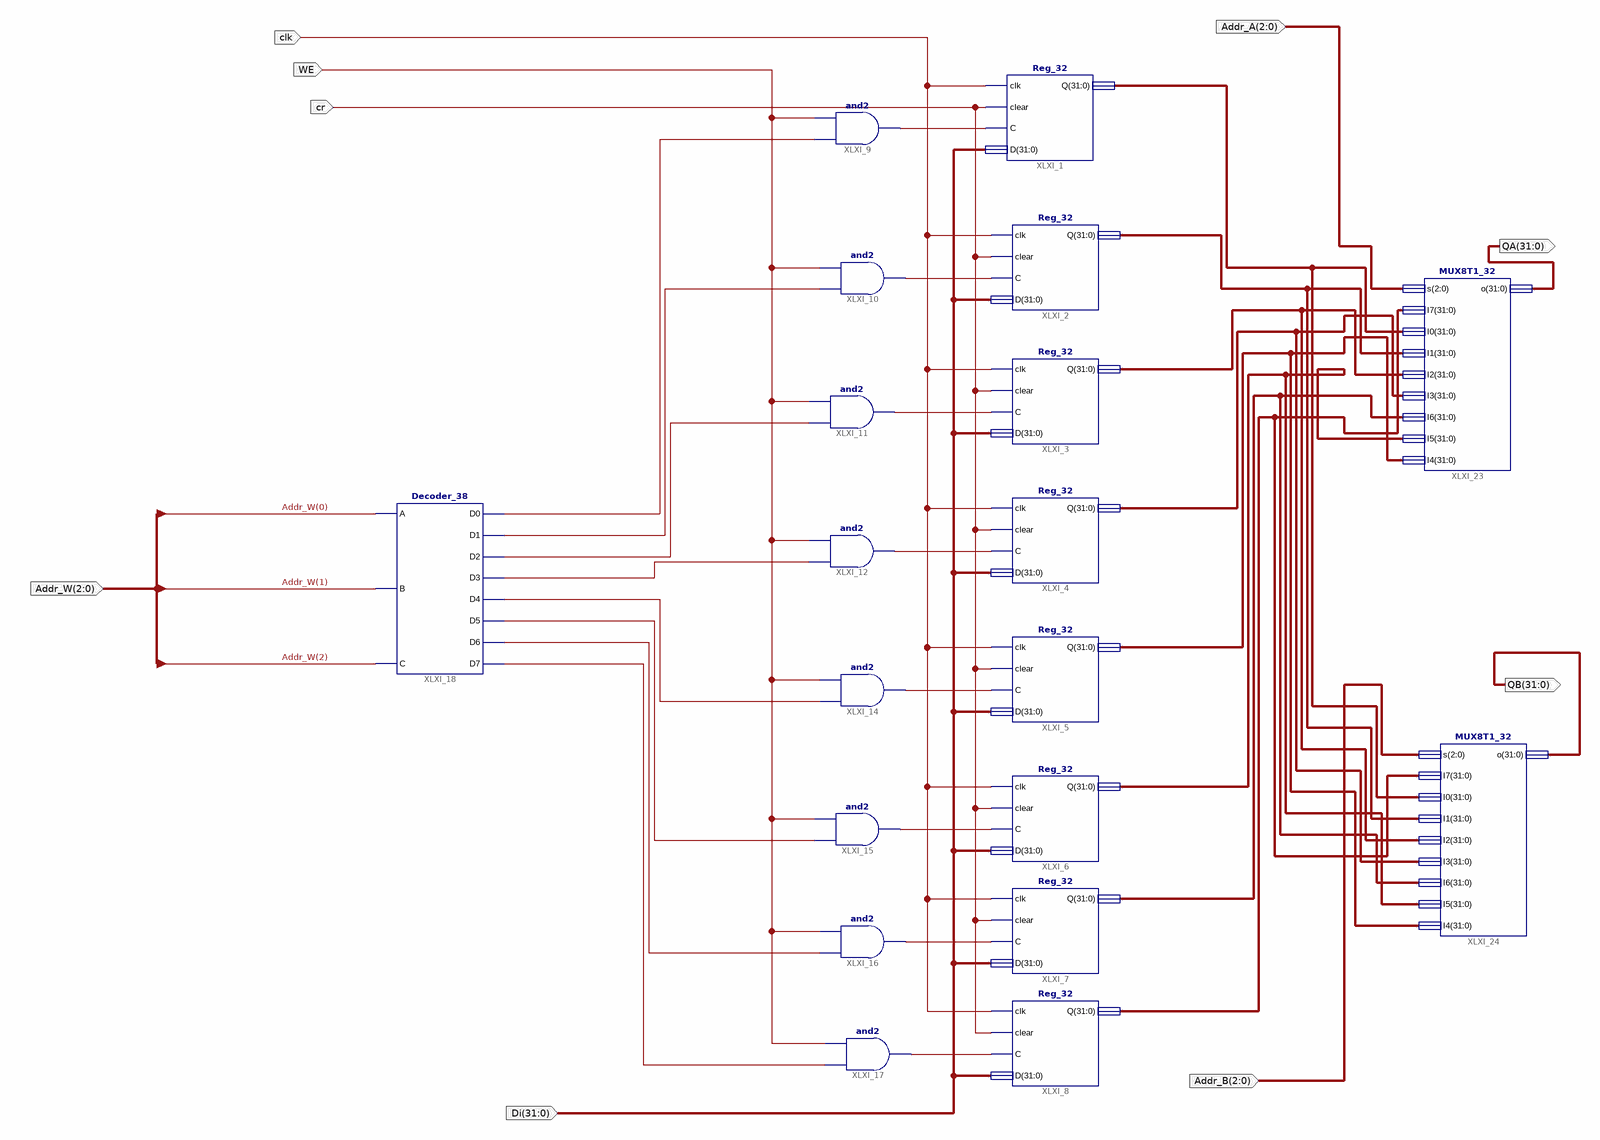
[diagram p0: schematic sheet 1]
// Xilinx ISE schematic Regs_8_32.sch (kintex7) as structural Verilog: 19 symbols, 9 ports
module Regs_8_32 (
  input  clk,
  input  [31:0] Di,
  input  [2:0] Addr_W,
  input  WE,
  input  [2:0] Addr_A,
  input  [2:0] Addr_B,
  input  cr,
  output [31:0] QA,
  output [31:0] QB
);

  wire XLXN_1, XLXN_2, XLXN_3, XLXN_4, XLXN_5, XLXN_6, XLXN_7, XLXN_8, XLXN_37, XLXN_38, XLXN_39, XLXN_40,
       XLXN_41, XLXN_42, XLXN_43, XLXN_44;
  wire [31:0] XLXN_45, XLXN_46, XLXN_49, XLXN_50, XLXN_51, XLXN_52, XLXN_53, XLXN_54;

  Reg_32 XLXI_1 (.clk(clk), .clear(cr), .C(XLXN_1), .D(Di), .Q(XLXN_45));
  Reg_32 XLXI_2 (.clk(clk), .clear(cr), .C(XLXN_2), .D(Di), .Q(XLXN_46));
  Reg_32 XLXI_3 (.clk(clk), .clear(cr), .C(XLXN_3), .D(Di), .Q(XLXN_49));
  Reg_32 XLXI_4 (.clk(clk), .clear(cr), .C(XLXN_4), .D(Di), .Q(XLXN_50));
  Reg_32 XLXI_5 (.clk(clk), .clear(cr), .C(XLXN_5), .D(Di), .Q(XLXN_51));
  Reg_32 XLXI_6 (.clk(clk), .clear(cr), .C(XLXN_6), .D(Di), .Q(XLXN_52));
  Reg_32 XLXI_7 (.clk(clk), .clear(cr), .C(XLXN_7), .D(Di), .Q(XLXN_53));
  Reg_32 XLXI_8 (.clk(clk), .clear(cr), .C(XLXN_8), .D(Di), .Q(XLXN_54));
  and XLXI_9 (XLXN_1, XLXN_37, WE);
  and XLXI_10 (XLXN_2, XLXN_38, WE);
  and XLXI_11 (XLXN_3, XLXN_39, WE);
  and XLXI_12 (XLXN_4, XLXN_40, WE);
  and XLXI_14 (XLXN_5, XLXN_41, WE);
  and XLXI_15 (XLXN_6, XLXN_42, WE);
  and XLXI_16 (XLXN_7, XLXN_43, WE);
  and XLXI_17 (XLXN_8, XLXN_44, WE);
  Decoder_38 XLXI_18 (
    .A(Addr_W[0]), .B(Addr_W[1]), .C(Addr_W[2]), .D0(XLXN_37), .D1(XLXN_38), .D2(XLXN_39), .D3(XLXN_40),
    .D4(XLXN_41), .D5(XLXN_42), .D6(XLXN_43), .D7(XLXN_44));
  MUX8T1_32 XLXI_23 (
    .s(Addr_A), .I7(XLXN_54), .I0(XLXN_45), .I1(XLXN_46), .I2(XLXN_49), .I3(XLXN_50), .I6(XLXN_53),
    .I5(XLXN_52), .I4(XLXN_51), .o(QA));
  MUX8T1_32 XLXI_24 (
    .s(Addr_B), .I7(XLXN_54), .I0(XLXN_45), .I1(XLXN_46), .I2(XLXN_49), .I3(XLXN_50), .I6(XLXN_53),
    .I5(XLXN_52), .I4(XLXN_51), .o(QB));
endmodule
